# Altium schematic sheet LED3.SchDoc
size A4
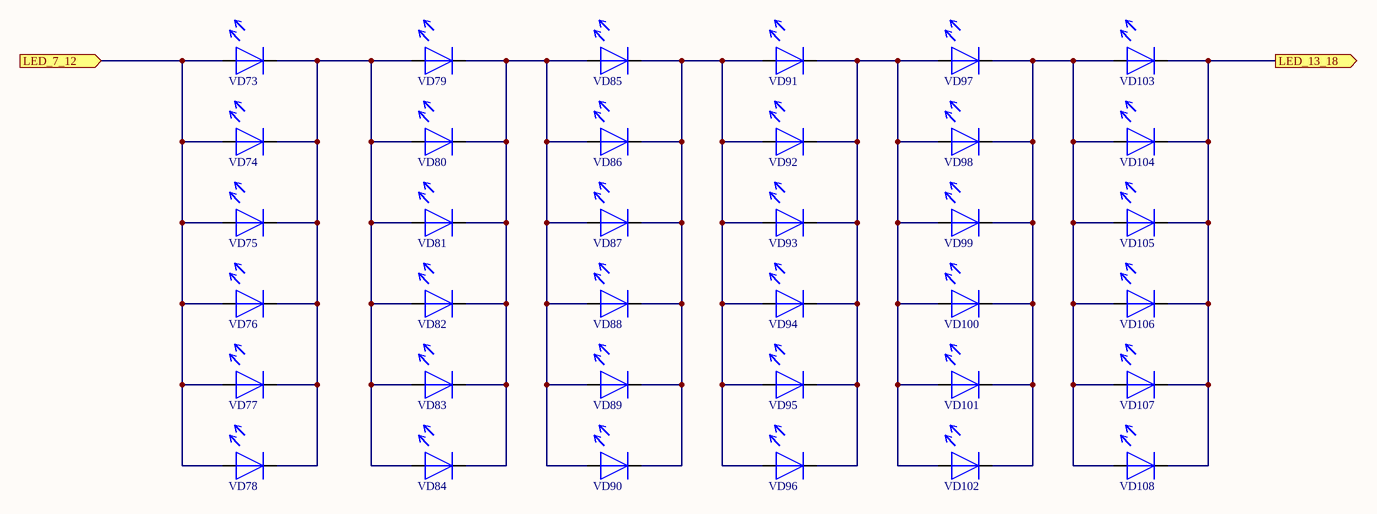
[diagram p0: LED3.SchDoc]

## Parts
VD73  SPMWHT541MD5WAT0SB  [LED_Samsung]  (value not drawn)
VD74  SPMWHT541MD5WAT0SB  [LED_Samsung]  (value not drawn)
VD75  SPMWHT541MD5WAT0SB  [LED_Samsung]  (value not drawn)
VD76  SPMWHT541MD5WAT0SB  [LED_Samsung]  (value not drawn)
VD77  SPMWHT541MD5WAT0SB  [LED_Samsung]  (value not drawn)
VD78  SPMWHT541MD5WAT0SB  [LED_Samsung]  (value not drawn)
VD79  SPMWHT541MD5WAT0SB  [LED_Samsung]  (value not drawn)
VD80  SPMWHT541MD5WAT0SB  [LED_Samsung]  (value not drawn)
VD81  SPMWHT541MD5WAT0SB  [LED_Samsung]  (value not drawn)
VD82  SPMWHT541MD5WAT0SB  [LED_Samsung]  (value not drawn)
VD83  SPMWHT541MD5WAT0SB  [LED_Samsung]  (value not drawn)
VD84  SPMWHT541MD5WAT0SB  [LED_Samsung]  (value not drawn)
VD85  SPMWHT541MD5WAT0SB  [LED_Samsung]  (value not drawn)
VD86  SPMWHT541MD5WAT0SB  [LED_Samsung]  (value not drawn)
VD87  SPMWHT541MD5WAT0SB  [LED_Samsung]  (value not drawn)
VD88  SPMWHT541MD5WAT0SB  [LED_Samsung]  (value not drawn)
VD89  SPMWHT541MD5WAT0SB  [LED_Samsung]  (value not drawn)
VD90  SPMWHT541MD5WAT0SB  [LED_Samsung]  (value not drawn)
VD91  SPMWHT541MD5WAT0SB  [LED_Samsung]  (value not drawn)
VD92  SPMWHT541MD5WAT0SB  [LED_Samsung]  (value not drawn)
VD93  SPMWHT541MD5WAT0SB  [LED_Samsung]  (value not drawn)
VD94  SPMWHT541MD5WAT0SB  [LED_Samsung]  (value not drawn)
VD95  SPMWHT541MD5WAT0SB  [LED_Samsung]  (value not drawn)
VD96  SPMWHT541MD5WAT0SB  [LED_Samsung]  (value not drawn)
VD97  SPMWHT541MD5WAT0SB  [LED_Samsung]  (value not drawn)
VD98  SPMWHT541MD5WAT0SB  [LED_Samsung]  (value not drawn)
VD99  SPMWHT541MD5WAT0SB  [LED_Samsung]  (value not drawn)
VD100  SPMWHT541MD5WAT0SB  [LED_Samsung]  (value not drawn)
VD101  SPMWHT541MD5WAT0SB  [LED_Samsung]  (value not drawn)
VD102  SPMWHT541MD5WAT0SB  [LED_Samsung]  (value not drawn)
VD103  SPMWHT541MD5WAT0SB  [LED_Samsung]  (value not drawn)
VD104  SPMWHT541MD5WAT0SB  [LED_Samsung]  (value not drawn)
VD105  SPMWHT541MD5WAT0SB  [LED_Samsung]  (value not drawn)
VD106  SPMWHT541MD5WAT0SB  [LED_Samsung]  (value not drawn)
VD107  SPMWHT541MD5WAT0SB  [LED_Samsung]  (value not drawn)
VD108  SPMWHT541MD5WAT0SB  [LED_Samsung]  (value not drawn)

## Ports
LED_7_12 (in), LED_13_18 (out)

## Nets
LED_7_12: VD73.1 VD74.1 VD75.1 VD76.1 VD77.1 VD78.1 ; port LED_7_12
LED_13_18: VD103.2 VD104.2 VD105.2 VD106.2 VD107.2 VD108.2 ; port LED_13_18
NetVD73_2: VD73.2 VD74.2 VD75.2 VD76.2 VD77.2 VD78.2 VD79.1 VD80.1 VD81.1 VD82.1 VD83.1 VD84.1
NetVD79_2: VD79.2 VD80.2 VD81.2 VD82.2 VD83.2 VD84.2 VD85.1 VD86.1 VD87.1 VD88.1 VD89.1 VD90.1
NetVD85_2: VD85.2 VD86.2 VD87.2 VD88.2 VD89.2 VD90.2 VD91.1 VD92.1 VD93.1 VD94.1 VD95.1 VD96.1
NetVD91_2: VD91.2 VD92.2 VD93.2 VD94.2 VD95.2 VD96.2 VD97.1 VD98.1 VD99.1 VD100.1 VD101.1 VD102.1
NetVD97_2: VD97.2 VD98.2 VD99.2 VD100.2 VD101.2 VD102.2 VD103.1 VD104.1 VD105.1 VD106.1 VD107.1 VD108.1

## Library data of the parts
VD73-VD108 = LED SPMWHT541MD5WAT0SB: Value: SPMWHT541MD5WAT0SB